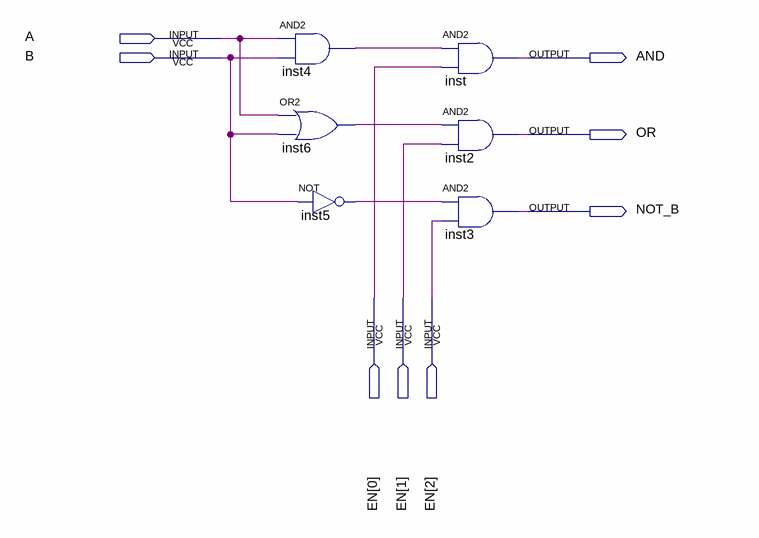
[diagram p0: schematic sheet]
// Quartus schematic logic_unit.bdf as structural Verilog: 6 symbols, 8 pins
module logic_unit (
  input  A,
  input  B,
  input  [2:0] EN,
  output AND,
  output OR,
  output NOT_B
);

  wire inst4_out, inst5_out, inst6_out;

  and inst4 (inst4_out, A, B);
  or inst6 (inst6_out, A, B);
  not inst5 (inst5_out, B);
  and inst (AND, inst4_out, EN[0]);
  and inst2 (OR, inst6_out, EN[1]);
  and inst3 (NOT_B, inst5_out, EN[2]);
endmodule
